# Altium schematic sheet gps.SchDoc
size A3; Date: Date; CompanyName: HESSO; Engineer: Name; Address1: Route du Rawyl 47; Address2: 1950 Sion; Address3: Switzerland; SheetNumber: 4; SheetTotal: 4; ProjectName: Project Name
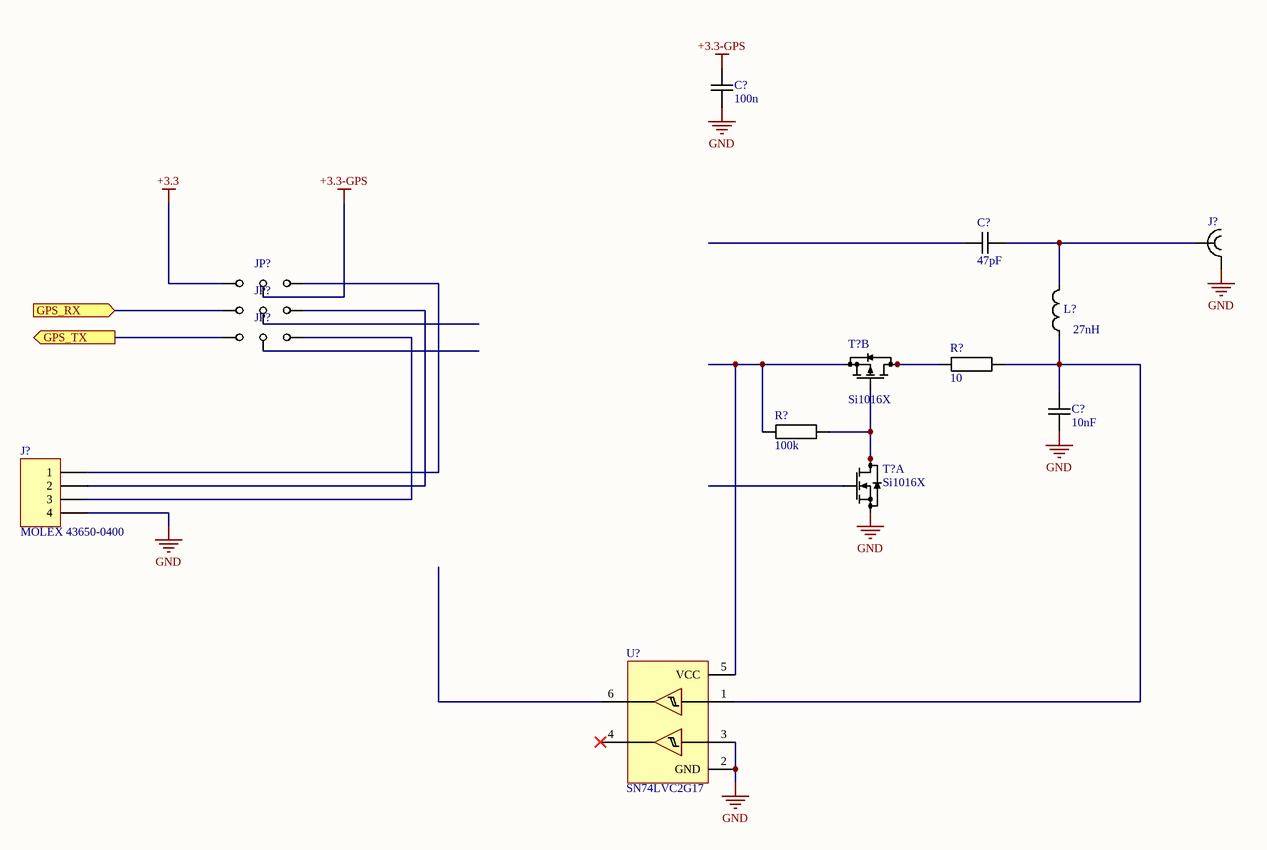
[diagram p0: gps.SchDoc]

## Parts
(Parts that share a designator on the sheet are numbered #1, #2 ... from top to bottom, then left to right.)
C?#1  100n  [CAPACITOR 1608 REFLOW]
C?#2  47pF  [CAPACITOR 1608 REFLOW]
C?#3  10nF  [CAPACITOR 1608 REFLOW]
J?#1  732511150  [SMA EDGE Molex 732511150]  (value not drawn)
J?#2  MOLEX 43650-0400  [MOLEX 43650-0400]
JP?#1  {Value}  [JUMPER3 SMD 1608]  (value not drawn)
JP?#2  {Value}  [JUMPER3 SMD 1608]  (value not drawn)
JP?#3  {Value}  [JUMPER3 SMD 1608]  (value not drawn)
L?  27nH  [INDUCTOR 0603 REFLOW]
R?#1  10  [RESISTOR 1005 REFLOW]
R?#2  100k  [RESISTOR 1005 REFLOW]
T?#1  Si1016X  [SOT563F P0.5 C1.6x1.2 H0.6]  (part B of 2)
T?#2  Si1016X  [SOT563F P0.5 C1.6x1.2 H0.6]  (part A of 2)
U?  SN74LVC2G17  [SOT23-6 P0.95 C1.5x3.0 H1.3]

## Ports
GPS_RX (in), GPS_TX (out)

## Nets
+3.3: JP?#1.1
+3.3-GPS: C?#1.2 JP?#1.2
GND: C?#1.1 C?#3.1 J?#1.2 J?#2.4 T?#2.1(S1) U?.2(GND) U?.3(2A)
GPS_RX: JP?#2.1 ; port GPS_RX
GPS_TX: JP?#3.1 ; port GPS_TX
NetC?#2_1: C?#2.1 J?#1.1 L?.2
NetC?#3_2: C?#3.2 L?.1 R?#1.2 U?.1(1A)
NetJ?#2_1: J?#2.1 JP?#1.3
NetJ?#2_2: J?#2.2 JP?#2.3
NetJ?#2_3: J?#2.3 JP?#3.3
NetR?#1_1: R?#1.1 T?#1.3(D2) T?#1.5(D2)
NetR?#2_1: R?#2.1 T?#1.4(S2) U?.5(VCC)
NetR?#2_2: R?#2.2 T?#1.5(G2) T?#2.6(D1) T?#2.7(D1)

Not connected (* = marked no-connect by the designer): C?#2 2; JP?#2 2; JP?#3 2; T?#2 2(G1); U? 4(2Y)* 6(1Y)

## Notes on the sheet
- Date :
- Revision :
- Sheet
- of
- Design by :

## Library data of the parts
C?#1-C?#3 = Capacitor: Value: *
J?#1 = SMA EDGE Molex 732511150: Value: 732511150
J?#2 = MOLEX 43650-0400: Micro-Fit 3.0 Right-Angle Header, 3.00mm Pitch, Single Row, 4 Circuits
JP?#1-JP?#3 = JUMPER 3 POS: Value: {Value}
L? = Inductor: Value: *
R?#1 R?#2 = Resistor: Value: *
T?#1 T?#2 = Si1016X: Complementary N- and P-Channel 20 V (D-S) MOSFET; Value: Si1016X
U? = SN74LVC2G17: Dual Schmitt-Trigger Buffer; Value: SN74LVC2G17